# Altium schematic sheet Boutconectie.SchDoc
size A4; SheetNumber: 3; SheetTotal: 4
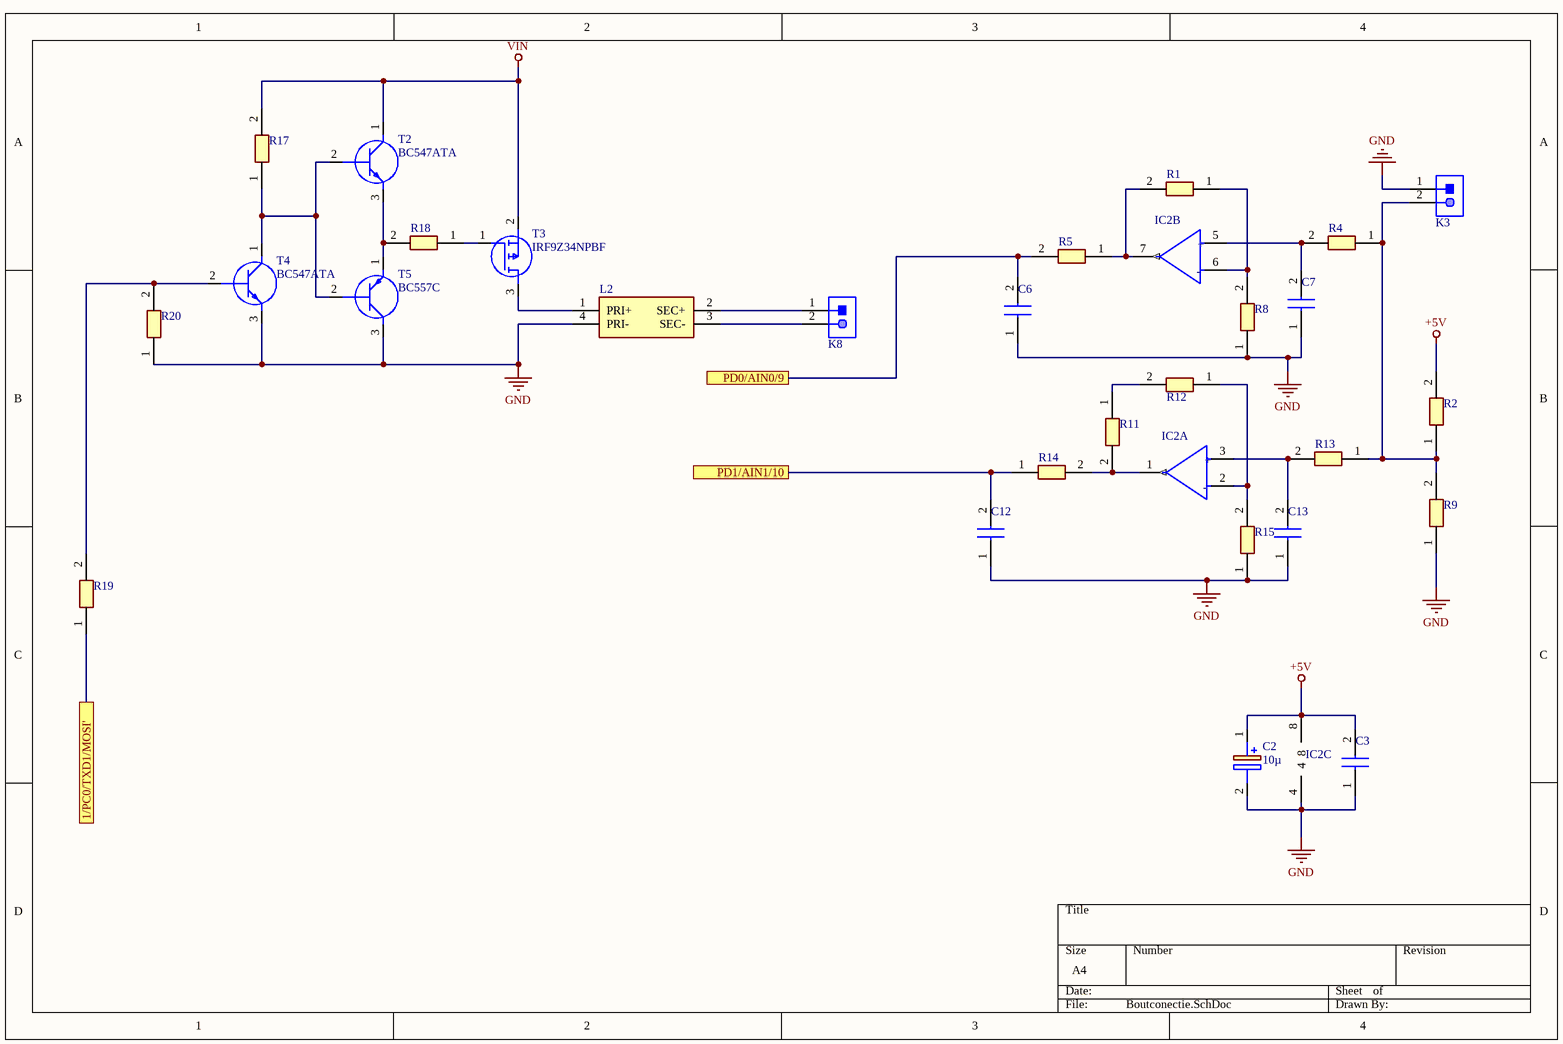
[diagram p0: Boutconectie.SchDoc]

## Parts
C2  10µ  [CAPPRD200W52D500H1250]
C3  (no value)  [CAPC2012X95N]
C6  (no value)  [CAPC2012X95N]
C7  (no value)  [CAPC2012X95N]
C12  (no value)  [CAPC2012X95N]
C13  (no value)  [CAPC2012X95N]
IC2  MCP6002-E_P  [DIP781W56P254L950H533Q8N]  (value not drawn)  (parts A,B,C of 3)
K3  620102131822  [620102131822]  (value not drawn)
K8  620102131822  [620102131822]  (value not drawn)
L2  CM2545X171B-10  [CM2545X171B10]  (value not drawn)
R1  (no value)  [RESC2012X90N]
R2  (no value)  [RESC2012X90N]
R4  (no value)  [RESC2012X90N]
R5  (no value)  [RESC2012X90N]
R8  (no value)  [RESC2012X90N]
R9  (no value)  [RESC2012X90N]
R11  (no value)  [RESC2012X90N]
R12  (no value)  [RESC2012X90N]
R13  (no value)  [RESC2012X90N]
R14  (no value)  [RESC2012X90N]
R15  (no value)  [RESC2012X90N]
R17  (no value)  [RESC2012X90N]
R18  (no value)  [RESC2012X90N]
R19  (no value)  [RESC2012X90N]
R20  (no value)  [RESC2012X90N]
T2  BC547ATA  [TO-92_(TO-226)]
T3  IRF9Z34NPBF  [TO254P469X1042X1967-3P]
T4  BC547ATA  [TO-92_(TO-226)]
T5  BC557C  [BC557C]

## Ports
1/PC0/TXD1/MOSI', PD0/AIN0/9, PD1/AIN1/10

## Nets
+5V: C2.1(+) C3.2 IC2.8 R2.2
GND: C2.2(-) C3.1 C6.1 C7.1 C12.1 C13.1 IC2.4 K3.1 L2.4(PRI-) R8.1 R9.1 R15.1 R20.1 T4.3(E) T5.3(C)
VIN: R17.2 T2.1(C) T3.2(S)
1/PC0/TXD1/MOSI': R19.1 ; port 1/PC0/TXD1/MOSI'
PD0/AIN0/9: C6.2 R5.2 ; port PD0/AIN0/9
PD1/AIN1/10: C12.2 R14.1 ; port PD1/AIN1/10
NetC7_2: C7.2 IC2.5(2IN+) R4.2
NetC13_2: C13.2 IC2.3(2IN+) R13.2
NetIC2_1: IC2.1(2OUT) R11.2 R14.2
NetIC2_2: IC2.2(2IN-) R12.1 R15.2
NetIC2_6: IC2.6(2IN-) R1.1 R8.2
NetIC2_7: IC2.7(2OUT) R1.2 R5.1
NetK3_2: K3.2 R2.1 R4.1 R9.2 R13.1
NetK8_1: K8.1 L2.2(SEC+)
NetK8_2: K8.2 L2.3(SEC-)
NetL2_1: L2.1(PRI+) T3.3(D)
NetR11_1: R11.1 R12.2
NetR17_1: R17.1 T2.2(B) T4.1(C) T5.2(B)
NetR18_1: R18.1 T3.1(G)
NetR18_2: R18.2 T2.3(E) T5.1(E)
NetR19_2: R19.2 R20.2 T4.2(B)

## Notes on the sheet
- (in symbol MCP6002-E_P, part A) +; -
- (in symbol MCP6002-E_P, part B) +; -

## Library data of the parts
C2 = 860010672009: Capacitor Polarised; Manufacturer_Name: Wurth Elektronik; Datasheet Link: https://componentsearchengine.com/Datasheets/2/860010672009.pdf; Height: 12.5mm; Manufacturer_Part_Number: 860010672009; Mouser Part Number: 710-860010672009; Mouser Price/Stock: https://www.mouser.com/Search/Refine.aspx?Keyword=710-860010672009
C3 C6 C7 C12 C13 = CC0805KPX7R9BB104: Capacitor; Manufacturer_Name: KEMET; Datasheet Link: https://www.yageo.com/upload/media/product/productsearch/datasheet/mlcc/UPY-GPHC_X7R_6.3V-to-50V_20.pdf; Height: 0.95mm; Manufacturer_Part_Number: CC0805KPX7R9BB104
IC2 = MCP6002-E_P: Integrated Circuit; Manufacturer_Name: Microchip; Manufacturer_Part_Number: MCP6002-E/P; Datasheet Link: http://componentsearchengine.com/Datasheets/3/MCP6002-E_P.pdf; Height: 5.334mm; Mouser Part Number: 579-MCP6002-E/P; Mouser Price/Stock: https://www.mouser.co.uk/ProductDetail/Microchip-Technology/MCP6002-E-P?qs=hul3WK2zl4pqRWzdnAsu%2FQ%3D%3D; Arrow Part Number: MCP6002-E/P; Arrow Price/Stock: https://www.arrow.com/en/products/mcp6002-ep/microchip-technology?region=nac
K3 K8 = CMP-1502-00669-1: Male Shrouded Header WR-WTB, SMT, Right Angled, pitch 2 mm, 1 x 2 position; Manufacturer: Wurth Elektronik; Position: 1x2; Working Voltage: 100VAC; Contact Resistance: 20mOhm; Pitch: 2mm; Packaging: TapeandReel; Part Number: 620102131822; Publisher: WurthElektronik; Mounting Technology: SMT; Manufacturer URL: http://www.we-online.de; Datasheet URL: https://katalog.we-online.de/em/datasheet/6201xx131822.pdf; Gender: Male; Operating Temperature: -25to85degC; Package Reference: 620102131822; Orientation: RightAngled
L2 = CM2545X171B-10: Transformer; Manufacturer_Name: Laird Technologies; Datasheet Link: https://datasheet.datasheetarchive.com/originals/dk/DKDS-7/122753.pdf; Height: 9.5mm; Manufacturer_Part_Number: CM2545X171B-10; Mouser Part Number: N/A; Mouser Price/Stock: https://www.mouser.co.uk/ProductDetail/Laird/CM2545X171B-10?qs=PzGy0jfpSMtNfkEypgU65A%3D%3D; Arrow Part Number: CM2545X171B-10; Arrow Price/Stock: https://www.arrow.com/en/products/cm2545x171b-10/laird-technologies
R1 R2 R4 R5 R8 R9 R11-R15 R17-R20 = CFN0805-JZ-R010ELF: Resistor; Manufacturer_Name: Bourns; Datasheet Link: https://www.bourns.com/docs/Product-Datasheets/CFN.pdf; Height: 0.9mm; Manufacturer_Part_Number: CFN0805-JZ-R010ELF
T2 T4 = BC547ATA: Transistor BJT NPN; Manufacturer_Name: ON Semiconductor; Datasheet Link: https://www.onsemi.com/pub/Collateral/BC550-D.pdf; Manufacturer_Part_Number: BC547ATA; Mouser Part Number: 512-BC547ATA; Mouser Price/Stock: https://www.mouser.co.uk/ProductDetail/ON-Semiconductor-Fairchild/BC547ATA?qs=ljbEvF4DwOMRdLfuzO8N4w%3D%3D; Arrow Part Number: BC547ATA; Arrow Price/Stock: https://www.arrow.com/en/products/bc547ata/on-semiconductor?region=europe
T3 = IRF9Z34NPBF: MOSFET (P-Channel); Manufacturer_Name: Infineon; Datasheet Link: https://www.infineon.com/dgdl/irf9z34npbf.pdf?fileId=5546d462533600a40153561220af1ddd; Height: 4.69mm; Manufacturer_Part_Number: IRF9Z34NPBF; Mouser Part Number: 942-IRF9Z34NPBF; Mouser Price/Stock: https://www.mouser.co.uk/ProductDetail/Infineon-IR/IRF9Z34NPBF?qs=9%252BKlkBgLFf16a%2FvlD%252BMCtQ%3D%3D; Arrow Part Number: IRF9Z34NPBF; Arrow Price/Stock: https://www.arrow.com/en/products/irf9z34npbf/infineon-technologies-ag?region=nac
T5 = BC557C: Transistor BJT PNP; Manufacturer_Name: NXP; Datasheet Link: http://uk.rs-online.com/web/p/products/1124775; Height: 5.2mm; Manufacturer_Part_Number: BC557C; Mouser Part Number: 771-BC557C; Mouser Price/Stock: https://www.mouser.co.uk/ProductDetail/NXP-Semiconductors/BC557C?qs=84A%2FDAdkstLO1yR4NjQrgg%3D%3D